# Altium schematic sheet max14866.SchDoc
size A4
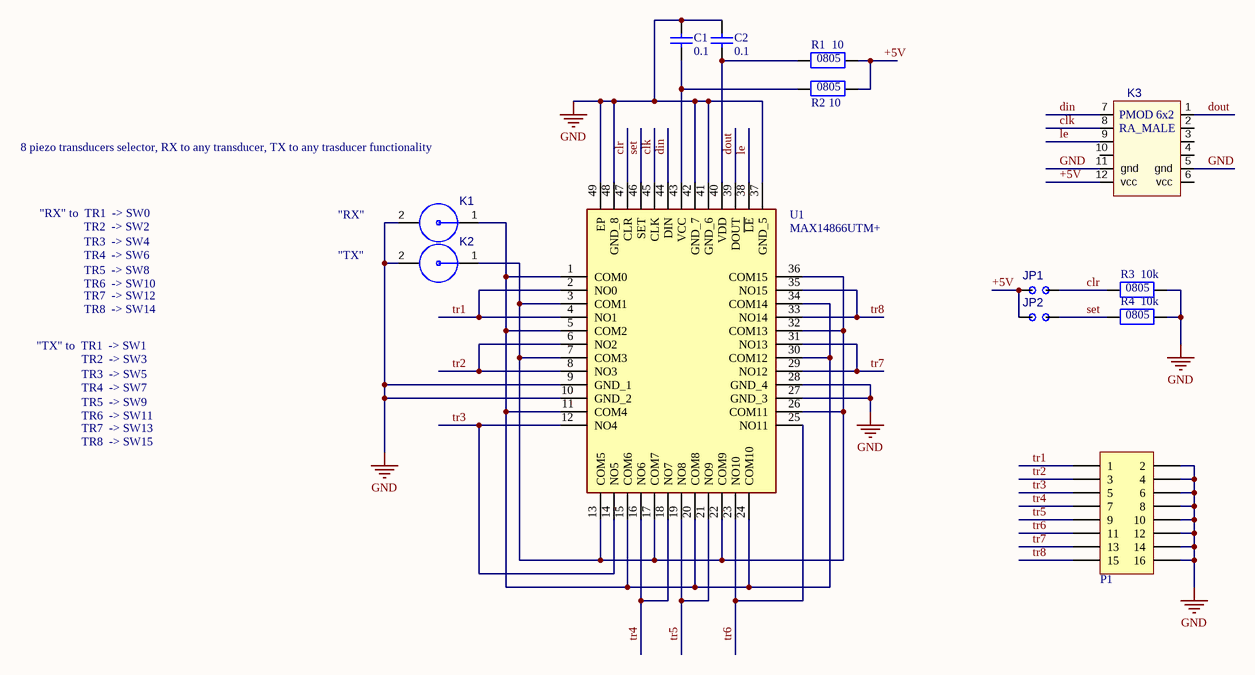
[diagram p0: max14866.SchDoc]

## Parts
C1  value 0.1  [SM0805]  (hidden comment: cap0805)
C2  value 0.1  [SM0805]  (hidden comment: cap0805)
JP1  JUMPER2  [JUMPER2]  (value not drawn)
JP2  JUMPER2  [JUMPER2]  (value not drawn)
K1  SMA_MALE_with_NUT  [AMPHENOL_MALE]  (value not drawn)
K2  SMA_MALE_with_NUT  [AMPHENOL_MALE]  (value not drawn)
K3  PMOD_6x2_ra_male_mirrored  [PMOD_6x2_RA_MALE_MIRRORED]  (value not drawn)
P1  2x8, 2.54mm vertical  [2x8 pin 2.54mm]  (value not drawn)
R1  value 10  [SM0805]  (hidden comment: res0805_EU)
R2  value 10  [SM0805]  (hidden comment: res0805_EU)
R3  value 10k  [SM0805]  (hidden comment: res0805_EU)
R4  value 10k  [SM0805]  (hidden comment: res0805_EU)
U1  MAX14866UTM+  [QFN50P700X700X80-49N]

## Nets
GND: C1.2 C2.2 K1.2 K2.2 K3.5(gnd) K3.11(gnd) P1.2 P1.4 P1.6 P1.8 P1.10 P1.12 P1.14 P1.16 R3.2 R4.2 U1.9(GND_1) U1.10(GND_2) U1.27(GND_3) U1.28(GND_4) U1.37(GND_5) U1.41(GND_6) U1.42(GND_7) U1.48(GND_8) U1.49(EP)
+5V: JP1.2 JP2.2 K3.12(vcc) R1.2 R2.2
clk: K3.8 U1.45(CLK)
clr: JP1.1 R3.1 U1.47(CLR)
din: K3.7 U1.44(DIN)
dout: K3.1 U1.39(DOUT)
le: K3.9 U1.38(~{LE})
set: JP2.1 R4.1 U1.46(SET)
tr1: P1.1 U1.2(NO0) U1.4(NO1)
tr2: P1.3 U1.6(NO2) U1.8(NO3)
tr3: P1.5 U1.12(NO4) U1.14(NO5)
tr4: P1.7 U1.16(NO6) U1.18(NO7)
tr5: P1.9 U1.19(NO8) U1.21(NO9)
tr6: P1.11 U1.23(NO10) U1.25(NO11)
tr7: P1.13 U1.29(NO12) U1.31(NO13)
tr8: P1.15 U1.33(NO14) U1.35(NO15)
NetC1_1: C1.1 R2.1 U1.43(VCC)
NetC2_1: C2.1 R1.1 U1.40(VDD)
NetK1_1: K1.1 U1.1(COM0) U1.5(COM2) U1.11(COM4) U1.15(COM6) U1.20(COM8) U1.24(COM10) U1.30(COM12) U1.34(COM14)
NetK2_1: K2.1 U1.3(COM1) U1.7(COM3) U1.13(COM5) U1.17(COM7) U1.22(COM9) U1.26(COM11) U1.32(COM13) U1.36(COM15)

Not connected (* = marked no-connect by the designer): K3 2 3 4 6(vcc) 10

## Notes on the sheet
- 8 piezo transducers selector, RX to any transducer, TX to any trasducer functionality
- "RX" to  TR1  -> SW0
- TR2  -> SW2
- TR3  -> SW4
- TR4  -> SW6
- TR5  -> SW8
- "TX"
- "RX"
- TR6  -> SW10
- TR7  -> SW12
- TR8  -> SW14
- "TX" to  TR1  -> SW1
- TR2  -> SW3
- TR3  -> SW5
- TR4  -> SW7
- TR5  -> SW9
- TR6  -> SW11
- TR7  -> SW13
- TR8  -> SW15
- (in symbol PMOD_6x2_ra_male_mirrored) PMOD 6x2; RA_MALE
- (in symbol res0805_EU) 0805

## Library data of the parts
C1 C2 = cap0805: Capacitor; Published: 8-Jun-2000; LatestRevisionDate: 17-Jul-2002; LatestRevisionNote: Re-released for DXP Platform.; PackageReference: RAD-0.3; Publisher: Altium Limited; PackageDescription: Radial Cap, Thru-Hole; 2 Leads; 0.3 in Pin Spacing
K3 = PMOD_6x2_ra_male_mirrored: PMOD_6x2_right_angle; Value: *
P1 = 2x8, 2.54mm, vertical: Header, 16-Pin; LatestRevisionDate: 17-Jul-2002; LatestRevisionNote: Re-released for DXP Platform.; Publisher: Altium Limited
R1-R4 = res0805_EU: Resistor; Published: 8-Jun-2000; LatestRevisionDate: 29-May-2009; LatestRevisionNote: IPC-7351 Footprint Added.; PackageReference: J1-0603; Publisher: Altium Limited; PackageDescription: Chip Resistor
U1 = MAX14866UTM+: Integrated Circuit; Manufacturer_Name: Maxim Integrated; Datasheet Link: https://www.mouser.com/datasheet/2/256/MAX14866-1154497.pdf; Height: 0.8mm; Manufacturer_Part_Number: MAX14866UTM+; Mouser Part Number: 700-MAX14866UTM+; Mouser Price/Stock: https://www.mouser.co.uk/ProductDetail/Maxim-Integrated/MAX14866UTM%2b?qs=1mbolxNpo8f6nC88ZZmOdg%3D%3D
JP1 JP2 = JUMPER2: Value: *
K1 K2 = SMA_MALE_with_NUT: Value: *